# Altium schematic sheet LDO-12V.SchDoc
size A4
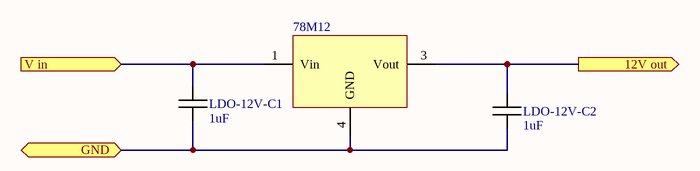
[diagram p0: LDO-12V.SchDoc]

## Parts
78M12  LDO 12V  [TO-252-AA]  (value not drawn)
LDO-12V-C1  1uF  [C 0805 / 2012]
LDO-12V-C2  1uF  [C 0805 / 2012]

## Ports
12V out (out), GND, V in (in)

## Nets
12V out: 78M12.3(Vout) LDO-12V-C2.2 ; port 12V out
GND: 78M12.4(GND) LDO-12V-C1.1 LDO-12V-C2.1 ; port GND
V in: 78M12.1(Vin) LDO-12V-C1.2 ; port V in

## Library data of the parts
78M12 = 78M12
LDO-12V-C1 LDO-12V-C2 = Capacitor